# Altium schematic sheet Power adapter board.SchDoc
size A3
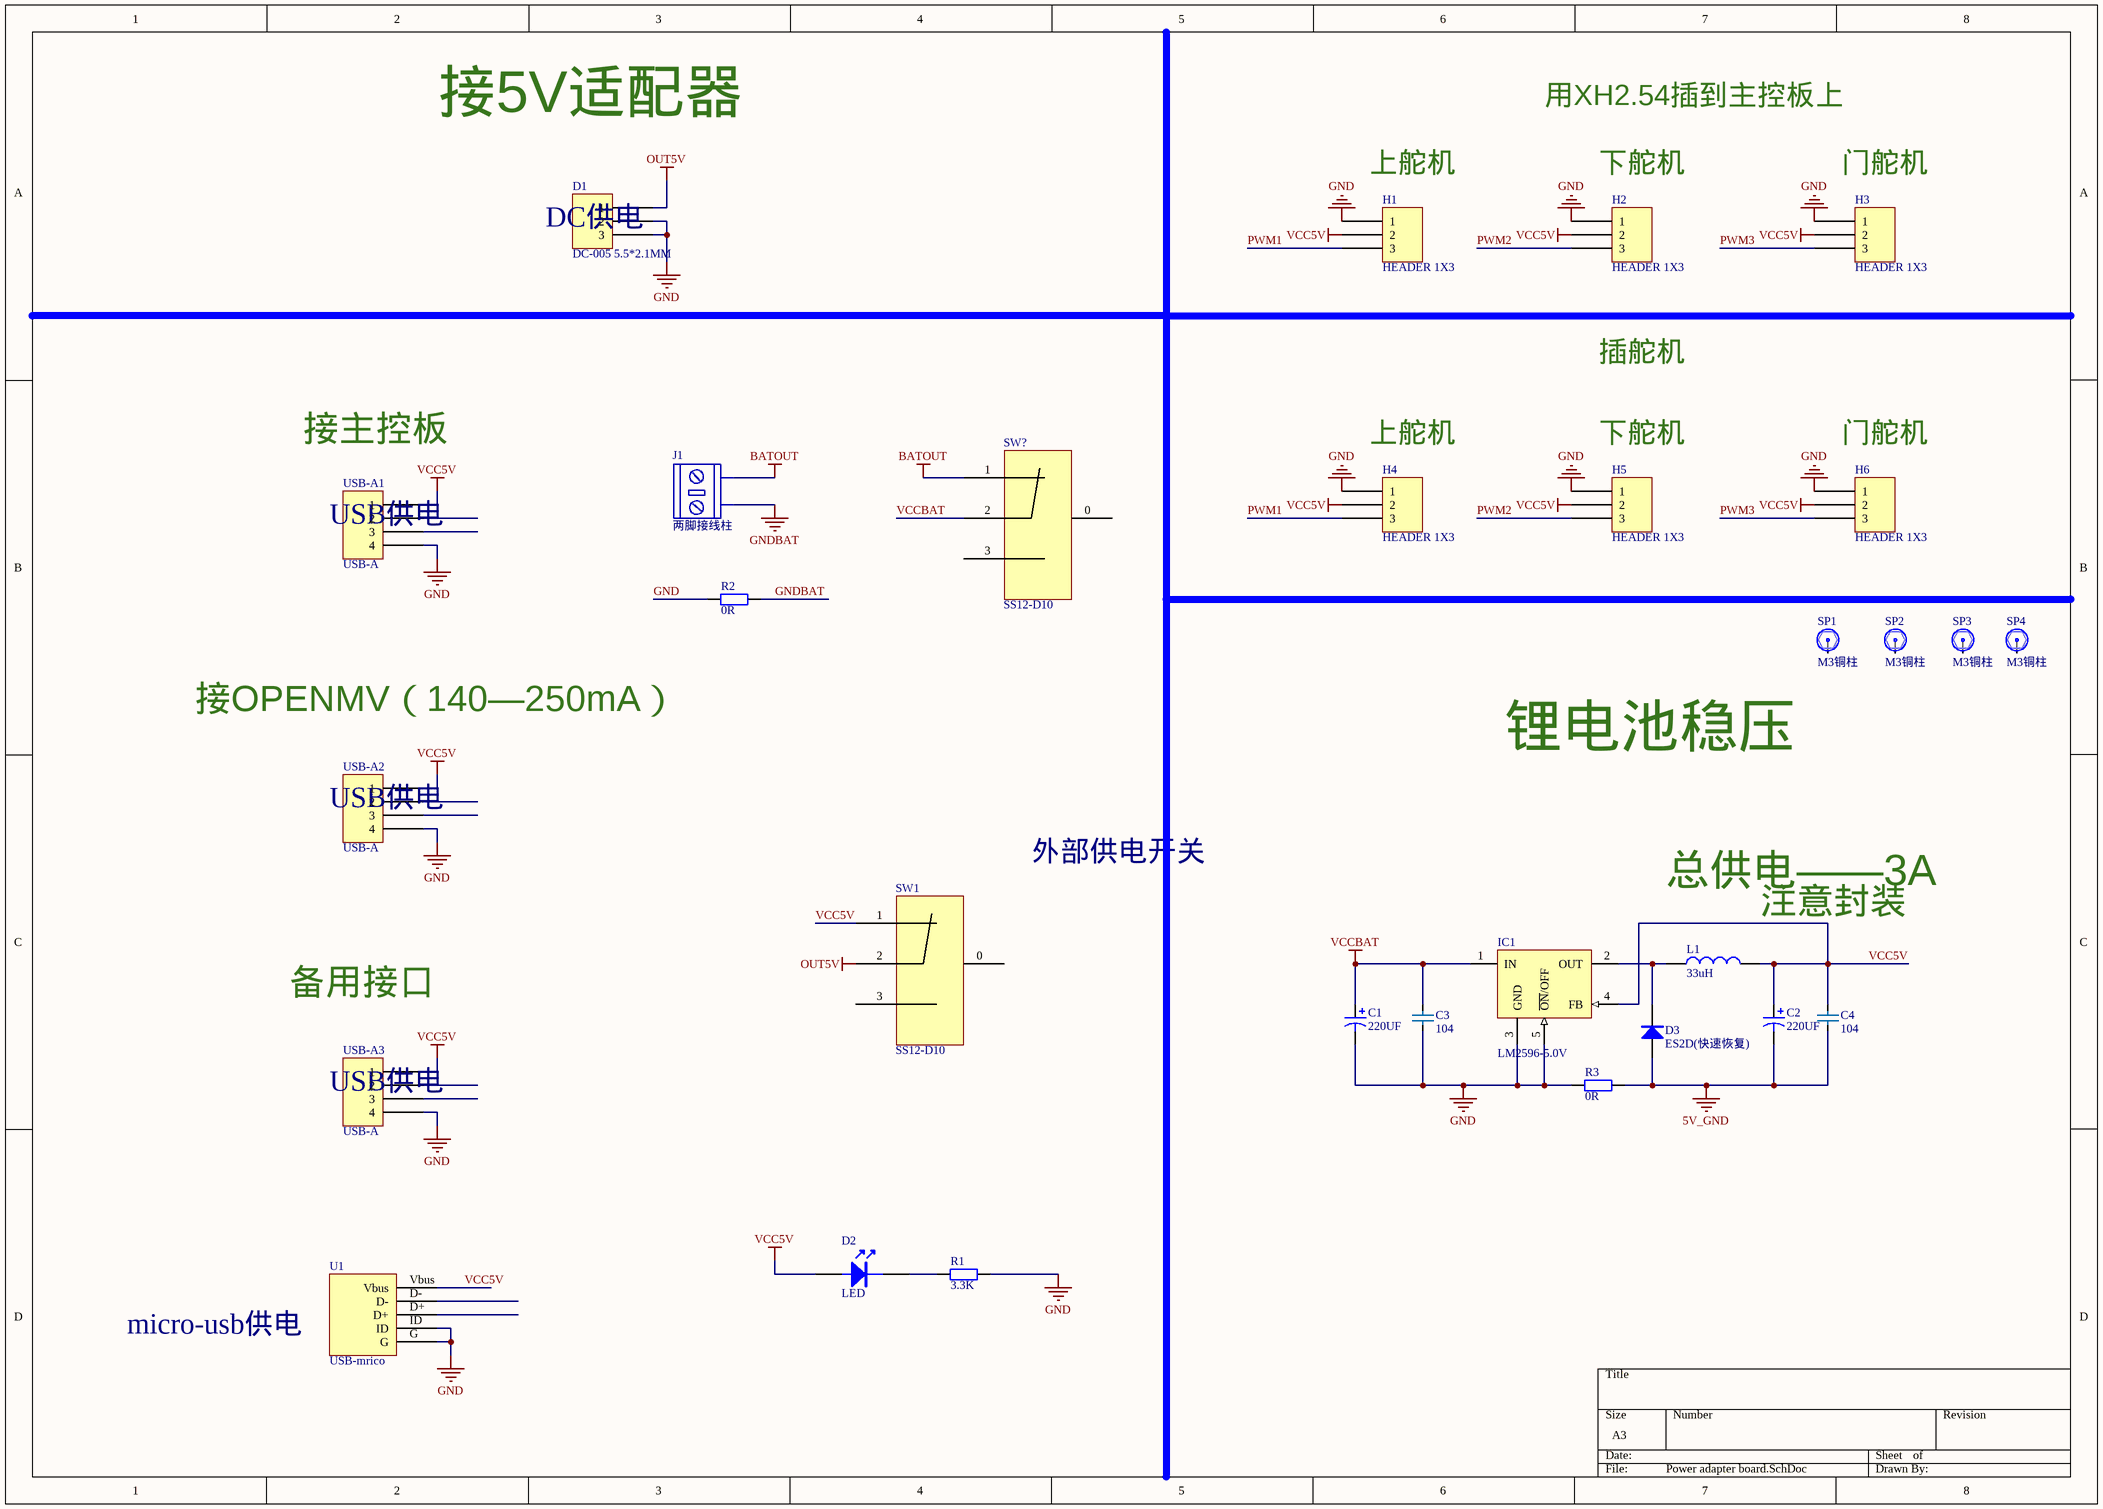
[diagram p0: Power adapter board.SchDoc]

## Parts
C1  220UF  [CM D(6.3*5.4)]
C2  220UF  [CM D(6.3*5.4)]
C3  104  [0603C]
C4  104  [0603C]
D1  DC-005 5.5*2.1MM  [DC-005]
D2  LED  [LED 0805]
D3  ES2D(快速恢复)  [SMA]
H1  HEADER 1X3  [XH2.54-LI-3P]
H2  HEADER 1X3  [XH2.54-LI-3P]
H3  HEADER 1X3  [XH2.54-LI-3P]
H4  HEADER 1X3  [XH2.54-LI-3P]
H5  HEADER 1X3  [XH2.54-LI-3P]
H6  HEADER 1X3  [XH2.54-LI-3P]
IC1  LM2596-5.0V  [TO263-5A]
J1  两脚接线柱  [两脚接线柱]
L1  33uH  [CDRH74]
R1  3.3K  [0603R]
R2  0R  [0603R]
R3  0R  [0603R]
SP1  M3铜柱  [M3x4+6_N]
SP2  M3铜柱  [M3x4+6_N]
SP3  M3铜柱  [M3x4+6_N]
SP4  M3铜柱  [M3x4+6_N]
SW1  SS12-D10  [SS-12F23]
SW?  SS12-D10  [SS-12F23]
U1  USB-mrico  [Micro_USB]
USB-A1  USB-A  [USB-A/S_C]
USB-A2  USB-A  [USB-A/S_C]
USB-A3  USB-A  [USB-A/S_C]

## Nets
5V_GND: C2.2 C4.1 D3.1(A) R3.2
BATOUT: J1.1(--) SW?.1
GND: C1.2 C3.1 D1.2 D1.3 H1.1 H2.1 H3.1 H4.1 H5.1 H6.1 IC1.3(GND) IC1.5(~{ON}/OFF) R1.2 R2.2 R3.1 U1.G U1.ID USB-A1.4 USB-A2.4 USB-A3.4
GNDBAT: J1.2(+) R2.1
OUT5V: D1.1 SW1.2
VCC5V: C2.1 C4.2 D2.A H1.2 H2.2 H3.2 H4.2 H5.2 H6.2 IC1.4(FB) L1.1 SW1.1 U1.Vbus USB-A1.1 USB-A2.1 USB-A3.1
VCCBAT: C1.1 C3.2 IC1.1(IN) SW?.2
PWM1: H1.3 H4.3
PWM2: H2.3 H5.3
PWM3: H3.3 H6.3
NetD2_K: D2.K R1.1
NetD3_2: D3.2(K) IC1.2(OUT) L1.2

Not connected (* = marked no-connect by the designer): SP1 1; SP2 1; SP3 1; SP4 1; SW1 0 3; SW? 0 3; U1 D+ D-; USB-A1 2 3; USB-A2 2 3; USB-A3 2 3

## Notes on the sheet
- 用XH2.54插到主控板上
- 接5V适配器
- (near H1) 上舵机
- (near H2) 下舵机
- (near H3) 门舵机
- DC供电
- 插舵机
- 接主控板
- (near H4) 上舵机
- (near H5) 下舵机
- (near H6) 门舵机
- USB供电
- 接OPENMV（140—250mA）
- 锂电池稳压
- 外部供电开关
- 总供电——3A
- (near L1) 注意封装
- 备用接口
- micro-usb供电

## Library data of the parts
C1 C2 = CAP-ELEC
C3 C4 = CAP-0805
D3 = M7: 整流二极管; 版权归属: 源创客; BOM名称: 整流二极管; 学习资源: www.ooocke.com
IC1 = LM2596-5.0: DC降压芯片; BOM名称: DC稳压芯片; 版权归属: 源创客; 学习资源: www.ooocke.com
L1 = L: 功率电感
R1-R3 = Res2: Resistor; Published: 8-Jun-2000; LatestRevisionDate: 17-Jul-2002; LatestRevisionNote: Re-released for DXP Platform.; Publisher: Altium Limited
SP1-SP4 = 铜柱加头大焊盘: 铜柱; 版权归属: 源创客; BOM名称: 铜柱; 学习资源: www.ooocke.com
SW1 SW? = SS12-F23
U1 = usb-STM